# EAGLE schematic PowerSup (EAGLE 7.7.0)
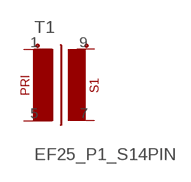
[diagram p0: schematic, sheet 1]

## Parts
T1  EF25_P1_S14PIN  [EF25_P1_S1-4PIN]
Unconnected: T1.1(P1-1) T1.5(P1-2) T1.7(S1-2) T1.9(S1-1)

## Library data of the parts
T1 = _Transformers:EF25_P1_S1